# Altium schematic sheet M2_USB_SATA.SchDoc
size A; SheetNumber: 11; SheetTotal: 11
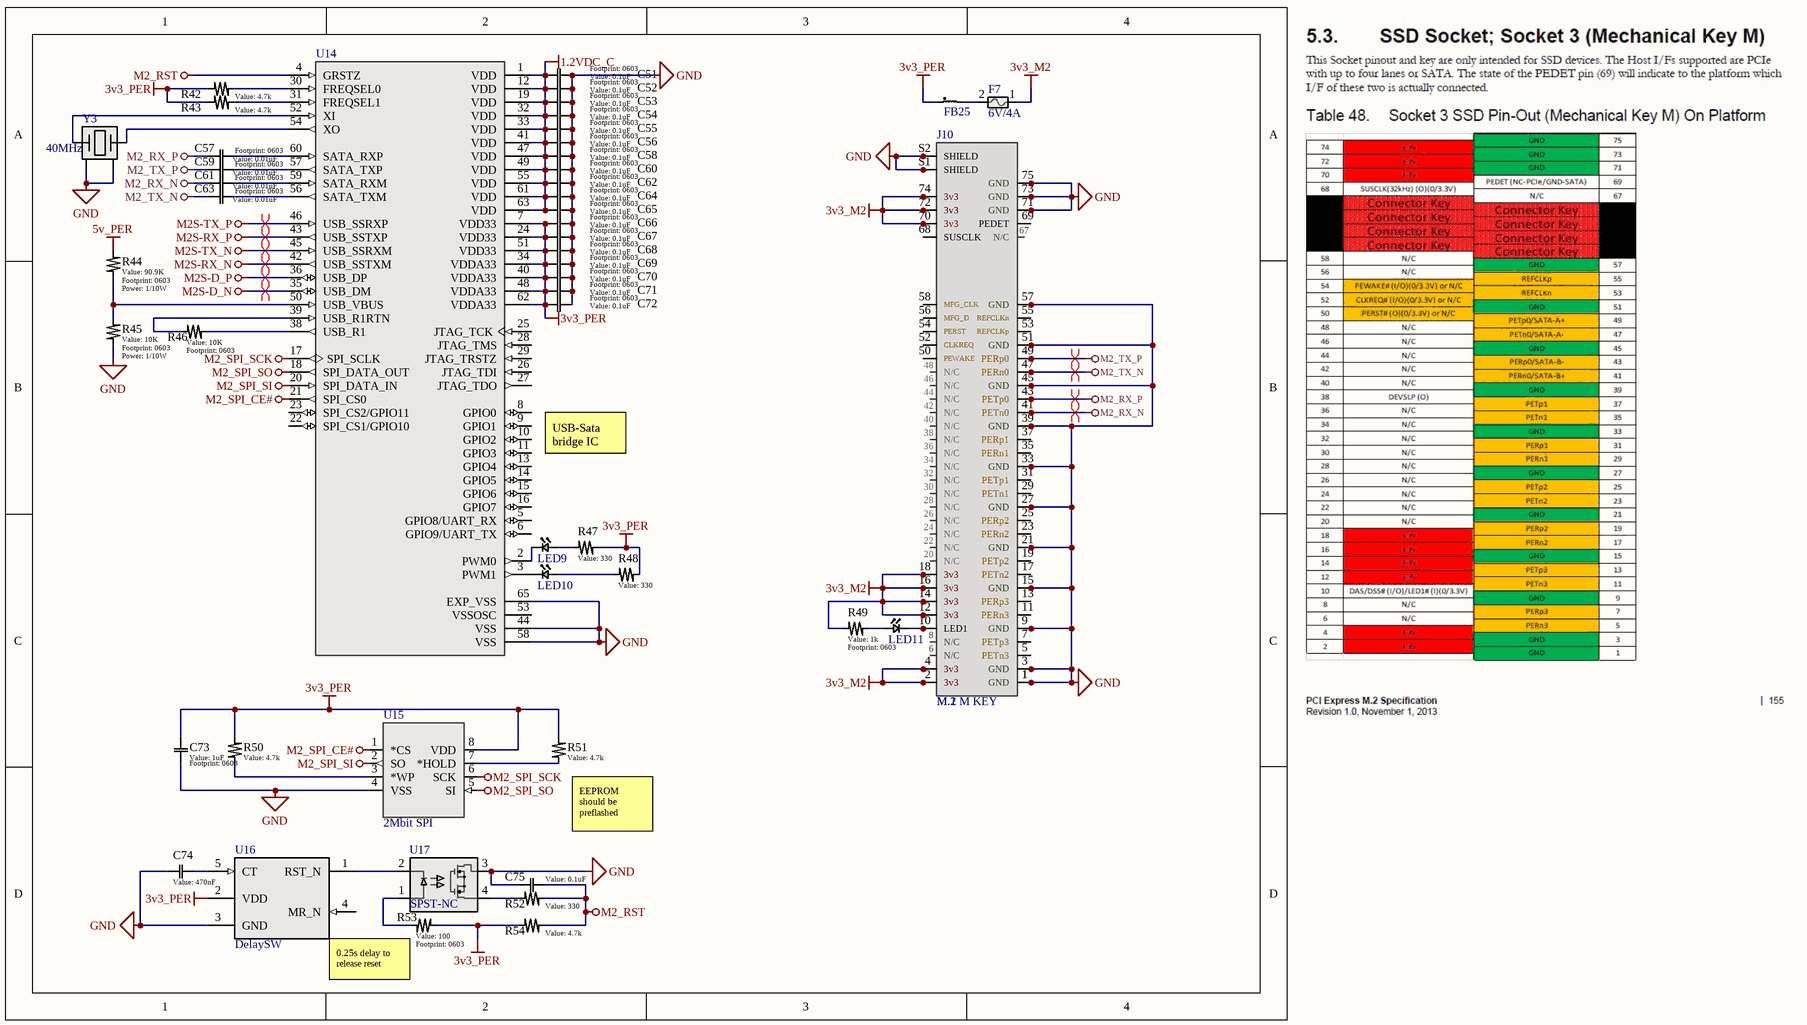
[diagram p0: M2_USB_SATA.SchDoc]

## Parts
C51  value 0.1uF  [0603]  (hidden comment: Generic Capacitor)
C52  value 0.1uF  [0603]  (hidden comment: Generic Capacitor)
C53  value 0.1uF  [0603]  (hidden comment: Generic Capacitor)
C54  value 0.1uF  [0603]  (hidden comment: Generic Capacitor)
C55  value 0.1uF  [0603]  (hidden comment: Generic Capacitor)
C56  value 0.1uF  [0603]  (hidden comment: Generic Capacitor)
C57  value 0.01uF  [0603]  (hidden comment: Generic Capacitor)
C58  value 0.1uF  [0603]  (hidden comment: Generic Capacitor)
C59  value 0.01uF  [0603]  (hidden comment: Generic Capacitor)
C60  value 0.1uF  [0603]  (hidden comment: Generic Capacitor)
C61  value 0.01uF  [0603]  (hidden comment: Generic Capacitor)
C62  value 0.1uF  [0603]  (hidden comment: Generic Capacitor)
C63  value 0.01uF  [0603]  (hidden comment: Generic Capacitor)
C64  value 0.1uF  [0603]  (hidden comment: Generic Capacitor)
C65  value 0.1uF  [0603]  (hidden comment: Generic Capacitor)
C66  value 0.1uF  [0603]  (hidden comment: Generic Capacitor)
C67  value 0.1uF  [0603]  (hidden comment: Generic Capacitor)
C68  value 0.1uF  [0603]  (hidden comment: Generic Capacitor)
C69  value 0.1uF  [0603]  (hidden comment: Generic Capacitor)
C70  value 0.1uF  [0603]  (hidden comment: Generic Capacitor)
C71  value 0.1uF  [0603]  (hidden comment: Generic Capacitor)
C72  value 0.1uF  [0603]  (hidden comment: Generic Capacitor)
C73  value 1uF  [0603]  (hidden comment: Generic Capacitor)
C74  value 470nF  [0603]  (hidden comment: Generic Capacitor)
C75  value 0.1uF  [0603]  (hidden comment: Generic Capacitor)
F7  6V/4A  [0805]
FB25  1206 Ferrite  [1206]  (value not drawn)
J10  M.2 M KEY  [1-2199230-6]
LED9  LTST-C191KGKT  [0603 (1608 Metric) Concave]  (value not drawn)
LED10  LTST-C191KGKT  [0603 (1608 Metric) Concave]  (value not drawn)
LED11  LTST-C191KGKT  [0603 (1608 Metric) Concave]  (value not drawn)
M.1  NVME Ref  [NVME-Ref 2242]  (value not drawn)
R42  value 4.7k  [0603]  (hidden comment: Generic Resistor)
R43  value 4.7k  [0603]  (hidden comment: Generic Resistor)
R44  value 90.9K  Power: 1/10W  [0603]  (hidden comment: Generic Resistor)
R45  value 10K  Power: 1/10W  [0603]  (hidden comment: Generic Resistor)
R46  value 10K  [0603]  (hidden comment: Generic Resistor)
R47  value 330  [0603]  (hidden comment: Generic Resistor)
R48  value 330  [0603]  (hidden comment: Generic Resistor)
R49  value 1k  [0603]  (hidden comment: Generic Resistor)
R50  value 4.7k  [0603]  (hidden comment: Generic Resistor)
R51  value 4.7k  [0603]  (hidden comment: Generic Resistor)
R52  value 330  [0603]  (hidden comment: Generic Resistor)
R53  value 100  [0603]  (hidden comment: Generic Resistor)
R54  value 4.7k  [0603]  (hidden comment: Generic Resistor)
U14  USB-SATA Bridge  [64-HTQFP (7x7)]  (value not drawn)
U15  2Mbit SPI  [8-SOIC (0.154", 3.90mm Width)]
U16  DelaySW  [TSOT-23-5]
U17  SPST-NC  [4-SOP]
Y3  40MHz  [SMD3225-4P]

## Nets
1.2VDC_C: C51.2 C52.2 C53.2 C54.2 C55.2 C56.2 C58.2 C60.2 C62.2 C64.2 C65.2 U14.1(VDD) U14.12(VDD) U14.19(VDD) U14.32(VDD) U14.33(VDD) U14.41(VDD) U14.47(VDD) U14.49(VDD) U14.55(VDD) U14.61(VDD) U14.63(VDD)
3v3_M2: F7.1 J10.2(3v3) J10.4(3v3) J10.12(3v3) J10.14(3v3) J10.16(3v3) J10.18(3v3) J10.70(3v3) J10.72(3v3) J10.74(3v3) M.1.2(3v3) M.1.4(3v3) M.1.12(3v3) M.1.14(3v3) M.1.16(3v3) M.1.18(3v3) M.1.70(3v3) M.1.72(3v3) M.1.74(3v3) R49.2
3v3_PER: C66.2 C67.2 C68.2 C69.2 C70.2 C71.2 C72.2 C73.1 FB25.1 R42.1 R43.1 R47.2 R48.2 R50.1 R51.1 R53.2 R54.1 U14.7(VDD33) U14.24(VDD33) U14.34(VDDA33) U14.40(VDDA33) U14.48(VDDA33) U14.51(VDD33) U14.62(VDDA33) U15.8(VDD) U16.2(VDD)
5v_PER: R44.1
GND: C51.1 C52.1 C53.1 C54.1 C55.1 C56.1 C58.1 C60.1 C62.1 C64.1 C65.1 C66.1 C67.1 C68.1 C69.1 C70.1 C71.1 C72.1 C73.2 C74.2 C75.1 J10.1(GND) J10.3(GND) J10.9(GND) J10.15(GND) J10.21(GND) J10.27(GND) J10.33(GND) J10.39(GND) J10.45(GND) J10.51(GND) J10.57(GND) J10.71(GND) J10.73(GND) J10.75(GND) J10.S1(SHIELD) J10.S2(SHIELD) M.1.1(GND) M.1.3(GND) M.1.9(GND) M.1.15(GND) M.1.21(GND) M.1.27(GND) M.1.33(GND) M.1.39(GND) M.1.45(GND) M.1.51(GND) M.1.57(GND) M.1.71(GND) M.1.73(GND) M.1.75(GND) M.1.S1(SHIELD) M.1.S2(SHIELD) M.1.SHD(SHIELD) R45.1 U14.44(VSS) U14.58(VSS) U14.65(EXP_VSS) U15.4(VSS) U16.3(GND) U17.3 Y3.2(GND) Y3.4(GND)
M2_RST: C75.2 R52.2 R54.2 U14.4(GRSTZ)
M2_RX_N: C61.2 J10.41(PETn0) M.1.41(PETn0)
M2_RX_P: C57.2 J10.43(PETp0) M.1.43(PETp0)
M2_SPI_CE#: U14.21(SPI_CS0) U15.1(*CS)
M2_SPI_SCK: U14.17(SPI_SCLK) U15.6(SCK)
M2_SPI_SI: U14.20(SPI_DATA_IN) U15.2(SO)
M2_SPI_SO: U14.18(SPI_DATA_OUT) U15.5(SI)
M2_TX_N: C63.2 J10.47(PERn0) M.1.47(PERn0)
M2_TX_P: C59.2 J10.49(PERp0) M.1.49(PERp0)
M2S-D_N: U14.35(USB_DM)
M2S-D_P: U14.36(USB_DP)
M2S-RX_N: U14.42(USB_SSTXM)
M2S-RX_P: U14.43(USB_SSTXP)
M2S-TX_N: U14.45(USB_SSRXM)
M2S-TX_P: U14.46(USB_SSRXP)
NetC57_1: C57.1 U14.60(SATA_RXP)
NetC59_1: C59.1 U14.57(SATA_TXP)
NetC61_1: C61.1 U14.59(SATA_RXM)
NetC63_1: C63.1 U14.56(SATA_TXM)
NetC74_1: C74.1 U16.5(CT)
NetF7_2: F7.2 FB25.2
NetJ10_5: J10.5(PETn3) M.1.5(PETn3)
NetJ10_6: J10.6(N/C) M.1.6(N/C)
NetJ10_7: J10.7(PETp3) M.1.7(PETp3)
NetJ10_8: J10.8(N/C) M.1.8(N/C)
NetJ10_10: J10.10(LED1) LED11.1(Cathode) M.1.10(LED1)
NetJ10_11: J10.11(PERn3) M.1.11(PERn3)
NetJ10_13: J10.13(PERp3) M.1.13(PERp3)
NetJ10_17: J10.17(PETn2) M.1.17(PETn2)
NetJ10_19: J10.19(PETp2) M.1.19(PETp2)
NetJ10_20: J10.20(N/C) M.1.20(N/C)
NetJ10_22: J10.22(N/C) M.1.22(N/C)
NetJ10_23: J10.23(PERn2) M.1.23(PERn2)
NetJ10_24: J10.24(N/C) M.1.24(N/C)
NetJ10_25: J10.25(PERp2) M.1.25(PERp2)
NetJ10_26: J10.26(N/C) M.1.26(N/C)
NetJ10_28: J10.28(N/C) M.1.28(N/C)
NetJ10_29: J10.29(PETn1) M.1.29(PETn1)
NetJ10_30: J10.30(N/C) M.1.30(N/C)
NetJ10_31: J10.31(PETp1) M.1.31(PETp1)
NetJ10_32: J10.32(N/C) M.1.32(N/C)
NetJ10_34: J10.34(N/C) M.1.34(N/C)
NetJ10_35: J10.35(PERn1) M.1.35(PERn1)
NetJ10_36: J10.36(N/C) M.1.36(N/C)
NetJ10_37: J10.37(PERp1) M.1.37(PERp1)
NetJ10_38: J10.38(N/C) M.1.38(N/C)
NetJ10_40: J10.40(N/C) M.1.40(N/C)
NetJ10_42: J10.42(N/C) M.1.42(N/C)
NetJ10_44: J10.44(N/C) M.1.44(N/C)
NetJ10_46: J10.46(N/C) M.1.46(N/C)
NetJ10_48: J10.48(N/C) M.1.48(N/C)
NetJ10_50: J10.50(PEWAKE) M.1.50(PEWAKE)
NetJ10_52: J10.52(CLKREQ) M.1.52(CLKREQ)
NetJ10_53: J10.53(REFCLKp) M.1.53(REFCLKp)
NetJ10_54: J10.54(PERST) M.1.54(PERST)
NetJ10_55: J10.55(REFCLKn) M.1.55(REFCLKn)
NetJ10_56: J10.56(MFG_D) M.1.56(MFG_D)
NetJ10_58: J10.58(MFG_CLK) M.1.58(MFG_CLK)
NetJ10_67: J10.67(N/C) M.1.67(N/C)
NetJ10_68: J10.68(SUSCLK) M.1.68(SUSCLK)
NetJ10_69: J10.69(PEDET) M.1.69(PEDET)
NetLED9_1: LED9.1(Cathode) U14.2(PWM0)
NetLED9_2: LED9.2(Anode) R47.1
NetLED10_1: LED10.1(Cathode) U14.3(PWM1)
NetLED10_2: LED10.2(Anode) R48.1
NetLED11_2: LED11.2(Anode) R49.1
NetR42_2: R42.2 U14.30(FREQSEL0)
NetR43_2: R43.2 U14.31(FREQSEL1)
NetR44_2: R44.2 R45.2 U14.50(USB_VBUS)
NetR46_1: R46.1 U14.39(USB_R1RTN)
NetR46_2: R46.2 U14.38(USB_R1)
NetR50_2: R50.2 U15.3(*WP)
NetR51_2: R51.2 U15.7(*HOLD)
NetR52_1: R52.1 U17.4
NetR53_1: R53.1 U17.1
NetU14_52: U14.52(XI) Y3.3
NetU14_54: U14.54(XO) Y3.1
NetU16_1: U16.1(RST_N) U17.2

Not connected (* = marked no-connect by the designer): U14 5(GPIO8/UART_RX) 6(GPIO9/UART_TX) 8(GPIO0) 9(GPIO1) 10(GPIO2) 11(GPIO3) 13(GPIO4) 14(GPIO5) 15(GPIO6) 16(GPIO7) 22(SPI_CS1/GPIO10) 23(SPI_CS2/GPIO11) 25(JTAG_TCK) 26(JTAG_TDI) 27(JTAG_TDO) 28(JTAG_TMS) 29(JTAG_TRSTZ) 53(VSSOSC); U16 4(MR_N)

## Layout directives
differential pair: M2_RX_N, M2_RX_P, M2_TX_N, M2_TX_P, M2S-D_N, M2S-D_P, M2S-RX_N, M2S-RX_P, M2S-TX_N, M2S-TX_P

## Notes on the sheet
- (near U14) USB-Sata bridge IC
- (near R51) EEPROM should be preflashed
- 0.25s delay to release reset
- REV
- REVISIONS
- DATE
- DESCRIPTION
- BY
- UNLESS OTHERWISE SPECIFIED, DRAWING DEFINITIONS AND TOLERANCES SHALL BE FOUND UNDER SUPPLIER STANDARDS SS-001. THIS PART AND ALL COMPONENTS OF IT MUST BE RoHS & REACH COMPLIANT. A CERTIFICATE OF COMPLIANCE MUST BE PROVIDED UPON REQUEST.
- ALL INFORMATION ON THIS DOCUMENT IS THE SOLE PROPERTY OF GAMBER-JOHNSON AND SHALL NOT BE COPIED, REPRODUCED, USED OR DISCLOSED IN WHOLE OR IN PART WITHOUT THE WRITTEN CONSENT OF GAMBER-JOHNSON
- TOLERANCES
  .00 ± .060
  .000 ± .020
  .0000 ± .005
  ANGELS ± 1°
- DRAWN BY:
- PROJECT NUMBER:
- SHEET TITLE:
- SHEET
- OF
- DATE:
- LOCATION:
- ASSEMBLY NUMBER
- SIZE
- GAMBER-JOHNSON LLC
  5001 JOERNS DR.
  STEVENS POINT, WI 54481
  +1 (715) 344-5209
- B

## Library data of the parts
C51-C72 C74 C75 = Generic Capacitor: Voltage: 10V; Tolerance: 10%
C73 = Generic Capacitor: Voltage: >10V; Tolerance: 10%
F7 = 0ZCK0100FF2E: Polymeric PTC Resettable Fuse 6V 1 A Ih Surface Mount 0805 (2012 Metric), Concave; Manufacturer: Bel; Max Current Rating: 40A; Hold Current: 1A; Trip Current: 1.95A; Time to Trip: 0.3s; Supplier 1: Digi-Key; Supplier Part Number 1: 507-1815-1-ND; Manufacturer Part Number: 0ZCK0100FF2E; RoHS: Yes; Category: PTC Resettable Fuses; Stock 1: 74738; Pricing 1: 1=0.27000, 5=0.26600, 10=0.25400, 50=0.22620, 100=0.21060, 250=0.18720, 500=0.15600, 1000=0.14820 (USD); Mount: Surface Mount; Case/Package: 0805; Case Code (Metric): 2012; Case Code (Imperial): 0805; Contact Plating: Tin,Matte; Min Operating Temperature: -40°C; Max Operating Temperature: 85°C; Package Quantity: 1; Packaging: Tape and Reel; RoHS Compliant: Yes; ComponentLink1URL: https://datasheet.ciiva.com/18550/0zck-18550620.pdf?src-supplier=Digi-Key; ComponentLink1Description: https://datasheet.ciiva.com/18550/0zck-18550620.pdf?src-supplier=Digi-Key; ComponentLink2URL: https://datasheet.ciiva.com/18550/0zck-18550621.pdf?src-supplier=Digi-Key; ComponentLink2Description: https://datasheet.ciiva.com/18550/0zck-18550621.pdf?src-supplier=Digi-Key; ComponentLink3URL: https://datasheet.ciiva.com/18550/0zck-18550622.pdf?src-supplier=Digi-Key; ComponentLink3Description: https://datasheet.ciiva.com/18550/0zck-18550622.pdf?src-supplier=Digi-Key; LCSC PN: C70158
FB25 = HI1206T161R-10: 160 Ohms @ 100MHz 1 Power, Signal Line Ferrite Bead 1206 (3216 Metric) 6A 18mOhm; Manufacturer 1: Laird Steward; DC Resistance (DCR): 18mR; Number of Lines: 1; Impedance: 160R; Supplier 1: Digi-Key; Manufacturer Part Number 1: HI1206T161R-10; RoHS: Yes; Category: Fixed Inductors; Stock 1: 250713; Pricing 1: 1=0.20000, 10=0.15600, 25=0.12920, 50=0.11140, 100=0.10020, 250=0.08464, 500=0.07572, 1000=0.06458 (USD); Mount: Surface Mount; Case/Package: 1206; Weight: 0.0136oz; Case Code (Metric): 3216; Case Code (Imperial): 1206; Core Material: Ferrite; Material: Ferrite; Min Operating Temperature: -40°C; Max Operating Temperature: 125°C; Package Quantity: 1; Packaging: Tape and Reel; Max Current Rating: 6A; Current Rating: 6A; Max DC Current: 6A; Termination: SMD/SMT; Frequency: 100MHz; Test Frequency: 100MHz; Length: 3.2mm; Height: 0.071inch; Width: 0.063inch; Depth: 1.8mm; Lead Free: Lead Free; REACH SVHC: Unknown; ComponentLink1URL: https://datasheet.ciiva.com/22622/1685743-22622771.pdf?src-supplier=Element14; ComponentLink1Description: https://datasheet.ciiva.com/22622/1685743-22622771.pdf?src-supplier=Element14; ComponentLink2URL: https://datasheet.ciiva.com/16714/70065439-16714326.pdf?src-supplier=Allied+Electronics; ComponentLink2Description: https://datasheet.ciiva.com/16714/70065439-16714326.pdf?src-supplier=Allied+Electronics; Supplier Part Number 1: 240-2411-1-ND; LCSC PN: C2926396
J10 = 1-2199230-6: M.2 0.5PITCH 4.2H KEY M 30U AU; MF: TE Connectivity; Package: None; Digi-Key_Part_Number: A118046TR-ND; Purchase-URL: https://pricing.snapeda.com/search/part/1-2199230-6/?ref=eda; Check_prices: https://www.snapeda.com/parts/1-2199230-6/TE+Connectivity+AMP+Connectors/view-part/?ref=eda; MP: 1-2199230-6; SnapEDA_Link: https://www.snapeda.com/parts/1-2199230-6/TE+Connectivity+AMP+Connectors/view-part/?ref=snap; Value: *
LED9-LED11 = CMP-013-000000-1: LED Uni-Color Green 574nm 2-Pin Chip LED T/R; Manufacturer 1: Vishay Lite-On; Number of Elements: 1; Viewing Angle: 130°; Lens Transparency: Clear; Power Dissipation: 75mW; Test Current: 20mA; Lens Style: Rectangular,Colorless; Reverse Voltage: 5V; Lens Color: Colorless; Forward Current: 30mA; Dominant Wavelength: 571nm; Forward Voltage: 2V; Luminous Intensity: 35mcd; Case Code (Imperial): 0603; Width: 0.8mm; Depth: 0.8mm; Case Code (Metric): 1608; Packaging: Tape and Reel; Number of LEDs: 1; Lead Free: Lead Free; Package Quantity: 1; Illumination Color: Green; Design Item ID: LTST-C191KGKT; Color: Green; Mount: Surface Mount; Source: Diodes.SchLib; Radiation Hardening: No; Wavelength: 574nm; RoHS: Yes; Max Power Dissipation: 75mW; RoHS Compliant: Yes; Power Rating: 75mW; Case/Package: 0603; Length: 1.6mm; Component Type: Standard; Number of Pins: 2; Height: 0.55mm; Stock 1: 4150; Pin Count: 2; ComponentLink1Description: https://datasheet.ciiva.com/2109/ltst-c191kgkt-2109973.pdf?src-supplier=Digi-Key; Manufacturer Part Number 1: LTST-C191KGKT; Category: LEDs; Min Operating Temperature: -55°C; ComponentLink1URL: https://datasheet.ciiva.com/2109/ltst-c191kgkt-2109973.pdf?src-supplier=Digi-Key; Max Operating Temperature: 85°C; Pricing 1: 50=0.14800, 250=0.06800, 500=0.06400, 1250=0.05400, 2500=0.05100 (USD)
M.1 = NVME Ref: Overlay pads w/ 1-2199230-6 / Use standoff for mounting screws
R42 R43 R46-R54 = Generic Resistor: Tolerance: 1%; Power: 1/10W
R44 R45 = Generic Resistor: Tolerance: 1%
U14 = TUSB9261PVP: HDD, CD, DVD Drive Interface 64-HTQFP _7x7_; MF: Texas Instruments; Package: HTQFP-64 Texas Instruments; Digi-Key_Part_Number: 296-28827-ND; SnapEDA_Link: https://www.snapeda.com/parts/TUSB9261PVP/Texas%20Instruments/view-part/1218116/?ref=snap; Digi-Key_Purchase_URL: https://www.digikey.com/product-detail/en/texas-instruments/TUSB9261PVP/296-28827-ND/2674328?utm_source=snapeda&utm_medium=aggregator&utm_campaign=symbol; Value: *; LCSC PN: C913832
U15 = LE25U20AMB-AH: IC FLASH 2MBIT SPI 30MHZ 8SOP; Mfr_Name: onsemi; RefDes: RefDes; Type: Type; LCSC PN: C603109
U16 = TPS3840DL22DBVR: Supervisor Open Drain or Open Collector 1 Channel SOT-23-5 / 2.2V Threshold; Mfr_Name: Texas Instruments; TYPE: TYPE; RefDes: RefDes; LCSC PN: C2867913; Supplier 1: Mouser; Supplier Part Number 1: 595-TPS3840DL22DBVR
U17 = CPC1117N: SSR RELAY SPST-NC 400MA 0-60V; Mfr_Name: Littelfuse Inc; RefDes: RefDes; Type: Type; LCSC PN: C150424
Y3 = L327S400H11L: 40MHz Surface Mount Crystal 10pF ±10ppm SMD3225-4P Crystal; LCSC PN: C5261245